# EasyEDA Pro project ProPrj_Tailtip_2026-06-10.epro, schematic Schematic1
Board Name: Board1; Create Date: 2026-06-08; Page Name: P1; Project Name: Tailtip; Schematic Name: Schematic1; Update Date: 2026-06-08; Company: FoxyLab; Drawed: ez4y2f; Page Size: A4; Version: V0.0.1
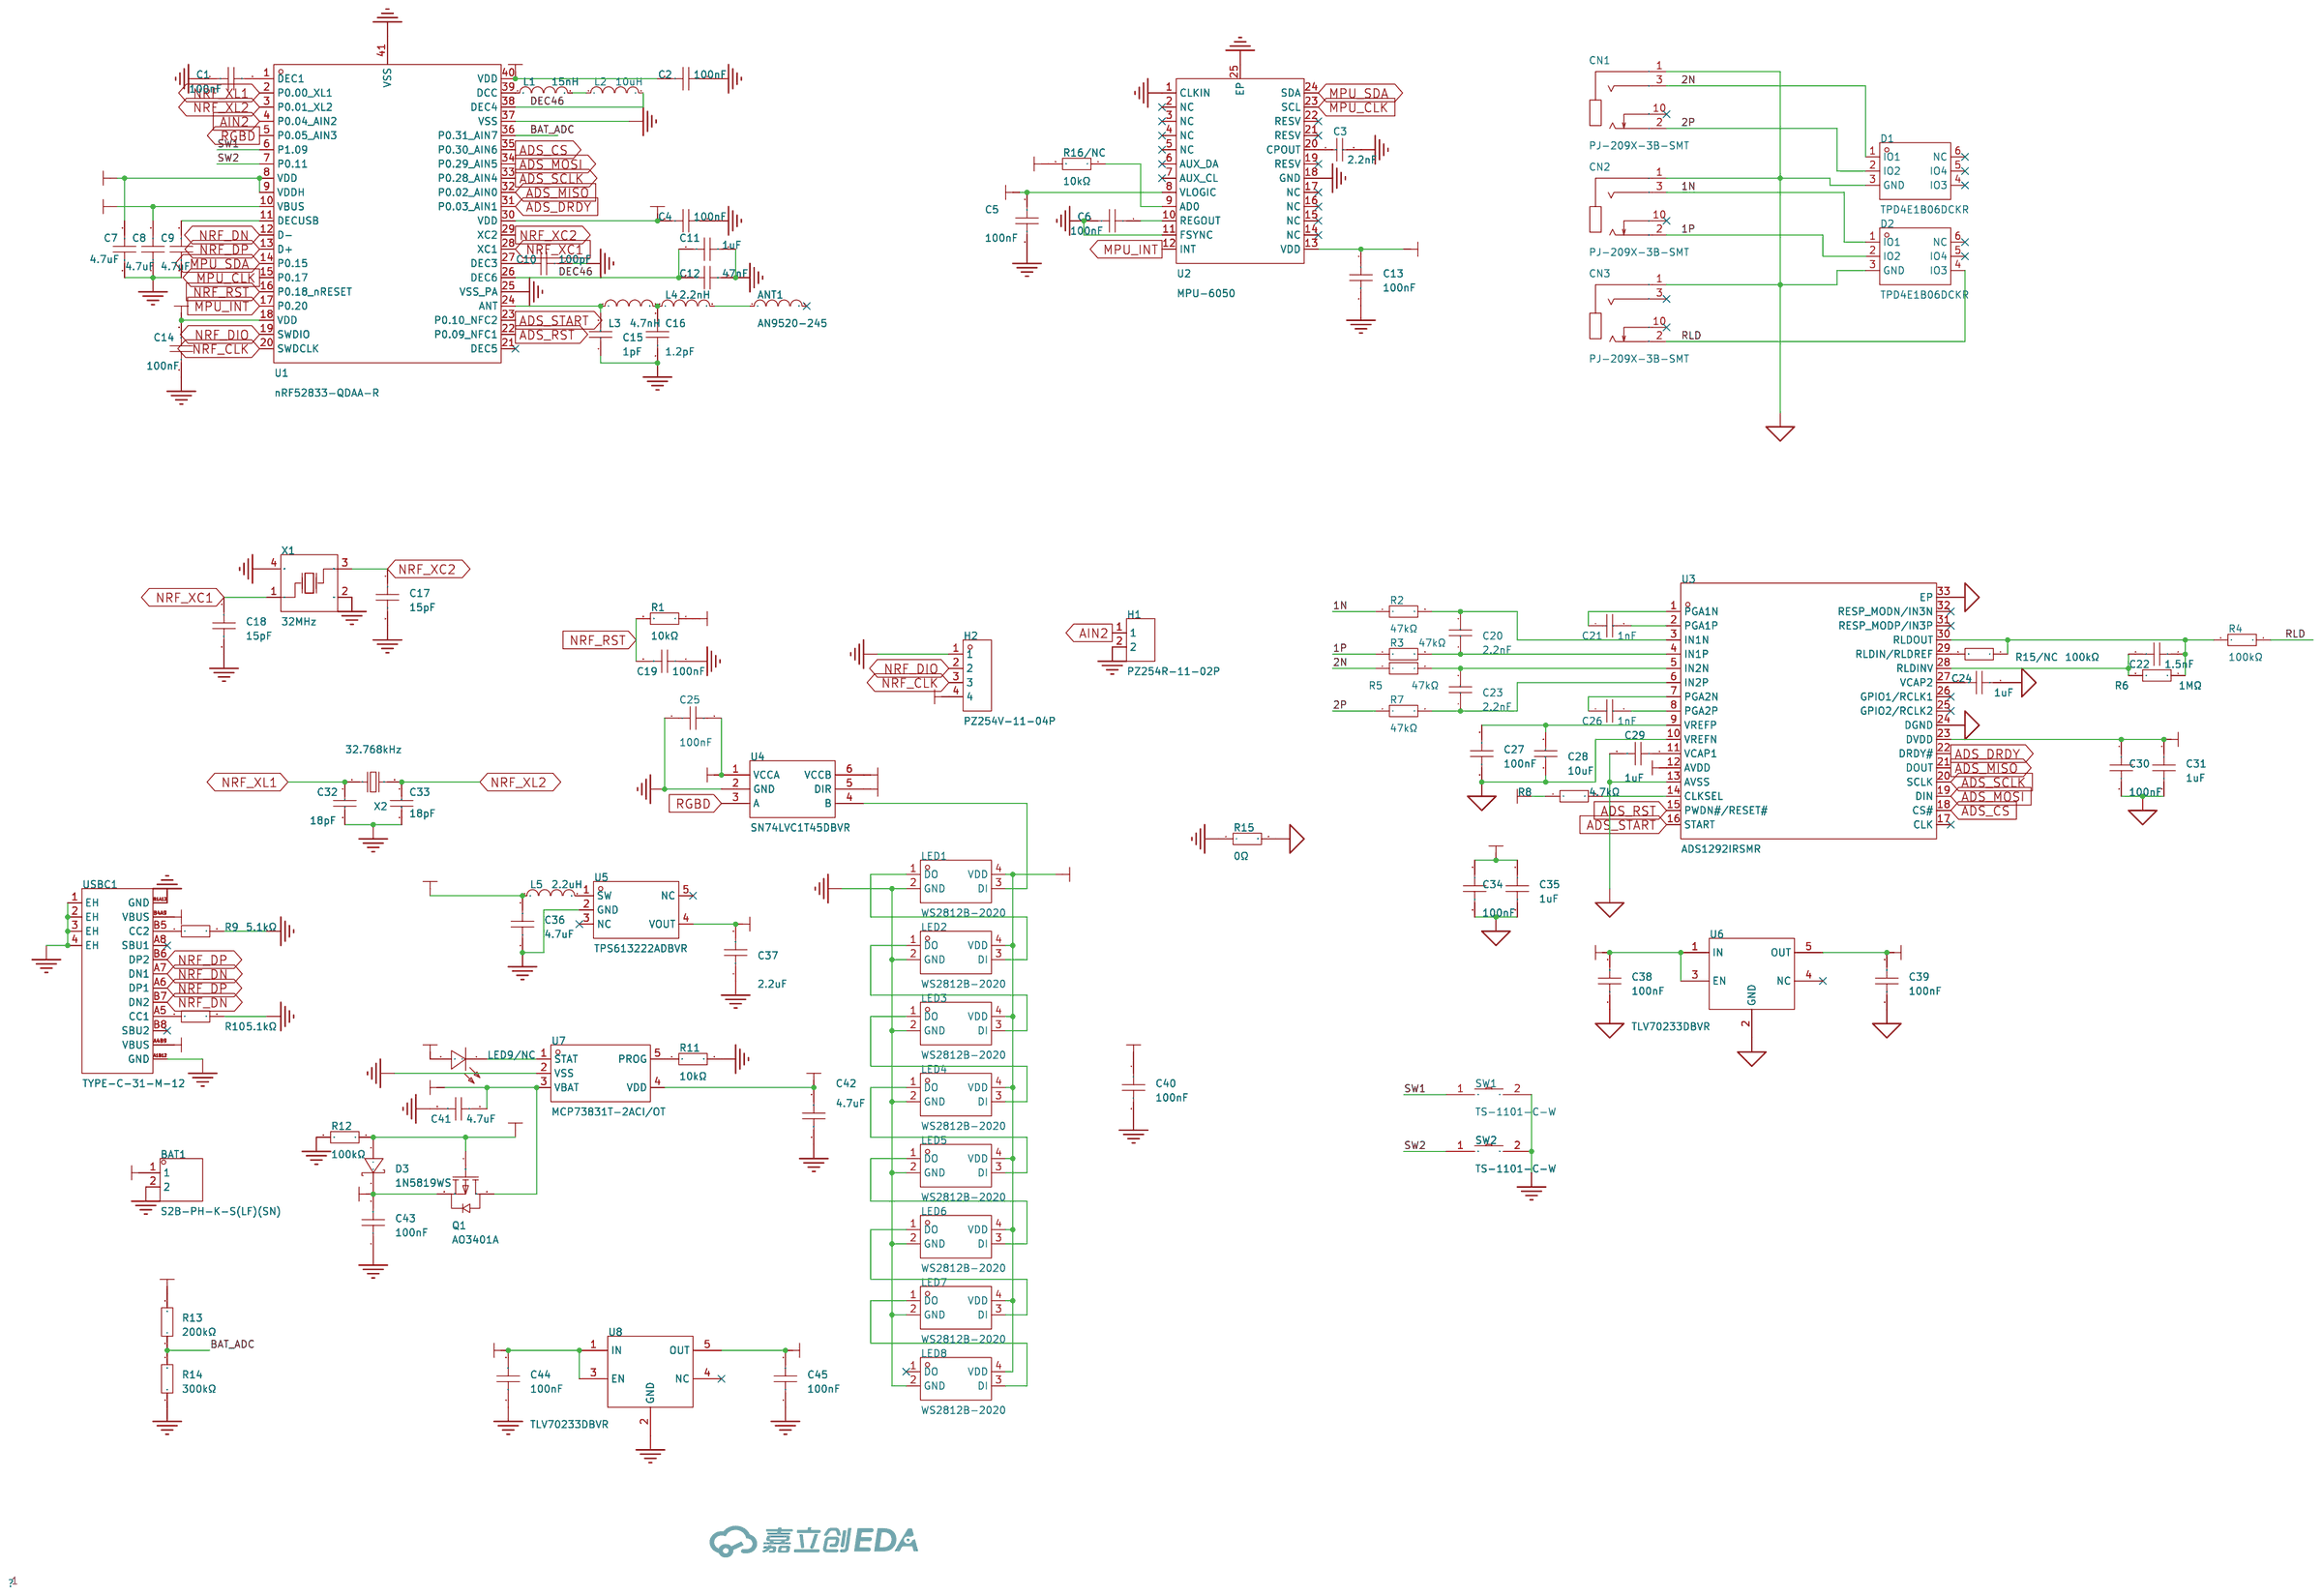
[diagram p0: schematic sheet]

## Parts
ANT1  AN9520-245  [ANT-SMD_L9.5-W2.1]
BAT1  S2B-PH-K-S(LF)(SN)  [CONN-TH_S2B-PH-K-S-LF-SN]
C1  100nF  [C0402]
C2  100nF  [C0402]
C3  2.2nF  [C0402]
C4  100nF  [C0402]
C5  100nF  [C0402]
C6  100nF  [C0402]
C7  4.7uF  [C0402]
C8  4.7uF  [C0402]
C9  4.7uF  [C0402]
C10  100pF  [C0402]
C11  1uF  [C0402]
C12  47nF  [C0402]
C13  100nF  [C0402]
C14  100nF  [C0402]
C15  1pF  [C0402]
C16  1.2pF  [C0402]
C17  15pF  [C0402]
C18  15pF  [C0402]
C19  100nF  [C0402]
C20  2.2nF  [C0402]
C21  1nF  [C0402]
C22  1.5nF  [C0402]
C23  2.2nF  [C0402]
C24  1uF  [C0402]
C25  100nF  [C0402]
C26  1nF  [C0402]
C27  100nF  [C0402]
C28  10uF  [C0402]
C29  1uF  [C0402]
C30  100nF  [C0402]
C31  1uF  [C0402]
C32  18pF  [C0402]
C33  18pF  [C0402]
C34  100nF  [C0402]
C35  1uF  [C0402]
C36  4.7uF  [C0402]
C37  2.2uF  [C0402]
C38  100nF  [C0402]
C39  100nF  [C0402]
C40  100nF  [C0402]
C41  4.7uF  [C0402]
C42  4.7uF  [C0402]
C43  100nF  [C0402]
C44  100nF  [C0402]
C45  100nF  [C0402]
CN1  PJ-209X-3B-SMT  [AUDIO-SMD_PJ-209X-3B-SMT]
CN2  PJ-209X-3B-SMT  [AUDIO-SMD_PJ-209X-3B-SMT]
CN3  PJ-209X-3B-SMT  [AUDIO-SMD_PJ-209X-3B-SMT]
D1  TPD4E1B06DCKR  [SC-70-6_L2.2-W1.3-P0.65-LS2.1-BL]
D2  TPD4E1B06DCKR  [SC-70-6_L2.2-W1.3-P0.65-LS2.1-BL]
D3  1N5819WS  [SOD-323_L1.8-W1.3-LS2.5-RD]
H1  PZ254R-11-02P  [HDR-TH_2P-P2.54-H-M-W10.4]
H2  PZ254V-11-04P  [HDR-TH_4P-P2.54-V-M]
L1  15nH  [L0402]
L2  10uH  [L0603]
L3  4.7nH  [L0402]
L4  2.2nH  [L0402]
L5  2.2uH  [IND-SMD_L1.0-W0.6_PLEA67BCA4R7M-1PT00]
LED1  WS2812B-2020  [LED-SMD_4P-L2.0-W2.0-TL_WS2812B-2020]
LED2  WS2812B-2020  [LED-SMD_4P-L2.0-W2.0-TL_WS2812B-2020]
LED3  WS2812B-2020  [LED-SMD_4P-L2.0-W2.0-TL_WS2812B-2020]
LED4  WS2812B-2020  [LED-SMD_4P-L2.0-W2.0-TL_WS2812B-2020]
LED5  WS2812B-2020  [LED-SMD_4P-L2.0-W2.0-TL_WS2812B-2020]
LED6  WS2812B-2020  [LED-SMD_4P-L2.0-W2.0-TL_WS2812B-2020]
LED7  WS2812B-2020  [LED-SMD_4P-L2.0-W2.0-TL_WS2812B-2020]
LED8  WS2812B-2020  [LED-SMD_4P-L2.0-W2.0-TL_WS2812B-2020]
LED9/NC  NCD0402G1  [LED-SMD_L1.0-W0.5_FC-F1005UGK]
Q1  AO3401A  [SOT-23_L2.9-W1.3-P1.90-LS2.4-BR]
R1  10kΩ  [R0402]
R2  47kΩ  [R0402]
R3  47kΩ  [R0402]
R4  100kΩ  [R0402]
R5  47kΩ  [R0402]
R6  1MΩ  [R0402]
R7  47kΩ  [R0402]
R8  4.7kΩ  [R0402]
R9  5.1kΩ  [R0402]
R10  5.1kΩ  [R0402]
R11  10kΩ  [R0402]
R12  100kΩ  [R0402]
R13  200kΩ  [R0402]
R14  300kΩ  [R0402]
R15  0Ω  [R0402]
R15/NC  100kΩ  [R0402]
R16/NC  10kΩ  [R0402]
SW1  TS-1101-C-W  [SW-SMD_L6.0-W3.3-LS8.0_TS-1101-C-W]
SW2  TS-1101-C-W  [SW-SMD_L6.0-W3.3-LS8.0_TS-1101-C-W]
U1  nRF52833-QDAA-R  [QFN-40_L5.0-W5.0-P0.40-TL-EP3.6]
U2  MPU-6050  [QFN-24_L4.0-W4.0-P0.50-BL-EP2.7]
U3  ADS1292IRSMR  [QFN-32_L4.0-W4.0-P0.40-TL-EP2.7]
U4  SN74LVC1T45DBVR  [SOT-23-6_L2.9-W1.6-P0.95-LS2.8-BR]
U5  TPS613222ADBVR  [TSOT-23-5_L2.9-W1.6-P0.95-LS2.8-BR]
U6  TLV70233DBVR  [SOT-23-5_L3.0-W1.7-P0.95-LS2.8-BR]
U7  MCP73831T-2ACI/OT  [SOT-23-5_L3.0-W1.7-P0.95-LS2.8-BL]
U8  TLV70233DBVR  [SOT-23-5_L3.0-W1.7-P0.95-LS2.8-BR]
USBC1  TYPE-C-31-M-12  [USB-C_SMD-TYPE-C-31-M-12_1]
X1  32MHz  [CRYSTAL-SMD_4P-L3.2-W2.5-BL]
X2  32.768kHz  [FC-135R_L3.2-W1.5]

## Library data of the parts
ANT1 = AN9520-245: 天线类型:贴片天线;中心频率:2.45GHz;带宽:200MHz;增益:1.5dBi;功率:3W;驻波比:2;; Supplier Part: C99665; Manufacturer: Rainsun(霖昱微); Supplier Footprint: SMD,2.1x9.5mm; JLCPCB Part Class: 扩展库; Datasheet: https://item.szlcsc.com/datasheet/AN9520-245/100880.html; Supplier: LCSC; Antenna Type: 贴片天线; Frequency(Center/Band): 2.45GHz; Bandwidth: 200MHz; Peak Gain: 1.5dBi; Impedance: 50Ω; Power: 3W; VSWR: 2; Operating Temperature: -40℃~+85℃; Length: 9.5mm; Width: 2.1mm; Height: 1mm
BAT1 = S2B-PH-K-S(LF)(SN): 插针结构:1x2P;间距:2mm;安装方式:弯插;参考系列:PH;总PIN数:2P;排数:1;每排PIN数:2;行距:-;额定电流:2A;触头材质:黄铜;触头镀层:锡;工作温度:-25℃~+85℃;; LCSC Part Name: 1x2P 间距:2mm 弯插 系列:PH; Supplier Part: C173752; Manufacturer: JST; Supplier Footprint: 弯插,P=2mm; JLCPCB Part Class: 扩展库; Datasheet: https://item.szlcsc.com/datasheet/S2B-PH-K-S(LF)(SN)/185142.html; Supplier: LCSC; Pins Structure: 1x2P; Pitch: 2mm; Mounting Type: 弯插; Reference Series: PH; Number of Pins: 2P; Number of Rows: 1; Number of PINs Per Row: 2; Current Rating: 2A; Contact Material: 黄铜; Contact Plating: 锡; Operating Temperature: -25℃~+85℃; Voltage Rating: 100V; Plastic Material: PA66; Flame Retardant Rating: UL94V-0; Supplementary Features: 打K脚; Color: 白色; Z-Height of the Board: 4.8mm; X-Length of Bottom Edge on Board (Spacing Line): 5.9mm; Y-Width of Bottom Edge on Board: 7.6mm
C1 C2 C4-C6 C13 C14 C19 C25 C27 C30 C34 C38-C40 C43-C45 = CC0402KRX7R7BB104: 容值:100nF;精度:±10%;额定电压:16V;温度系数:X7R;; LCSC Part Name: 100nF ±10% 16V; Supplier Part: C60474; Manufacturer: YAGEO(国巨); Supplier Footprint: 0402; JLCPCB Part Class: 扩展库; Datasheet: https://item.szlcsc.com/datasheet/CC0402KRX7R7BB104/61526.html; Supplier: LCSC; Tolerance: ±10%; Voltage Rating: 16V; Temperature Coefficient: X7R
C3 C20 C23 = CC0402KRX7R9BB222: 容值:2.2nF;精度:±10%;额定电压:50V;温度系数:X7R;; LCSC Part Name: 2.2nF ±10% 50V; Supplier Part: C106861; Manufacturer: YAGEO(国巨); Supplier Footprint: 0402; JLCPCB Part Class: 扩展库; Datasheet: https://item.szlcsc.com/datasheet/CC0402KRX7R9BB222/108077.html; Supplier: LCSC; Tolerance: ±10%; Voltage Rating: 50V; Temperature Coefficient: X7R
C7-C9 C36 C41 C42 = CC0402KRX5R6BB475: 容值:4.7uF;精度:±10%;额定电压:10V;温度系数:X5R;; LCSC Part Name: 4.7uF ±10% 10V; Supplier Part: C326586; Manufacturer: YAGEO(国巨); Supplier Footprint: 0402; JLCPCB Part Class: 扩展库; Datasheet: https://item.szlcsc.com/datasheet/CC0402KRX5R6BB475/306680.html; Supplier: LCSC; Tolerance: ±10%; Voltage Rating: 10V; Temperature Coefficient: X5R
C10 = CC0402FRNPO9BN101: 容值:100pF;精度:±1%;额定电压:50V;温度系数:NP0;; LCSC Part Name: 100pF ±1% 50V; Supplier Part: C327198; Manufacturer: YAGEO(国巨); Supplier Footprint: 0402; JLCPCB Part Class: 扩展库; Datasheet: https://item.szlcsc.com/datasheet/CC0402FRNPO9BN101/307292.html; Supplier: LCSC; Tolerance: ±1%; Voltage Rating: 50V; Temperature Coefficient: NP0
C11 C24 C29 C31 C35 = CC0402KRX7R6BB105: 容值:1uF;精度:±10%;额定电压:10V;温度系数:X7R;; LCSC Part Name: 1uF ±10% 10V; Supplier Part: C7500381; Manufacturer: YAGEO(国巨); Supplier Footprint: 0402; JLCPCB Part Class: 扩展库; Datasheet: https://item.szlcsc.com/datasheet/CC0402KRX7R6BB105/8577179.html; Supplier: LCSC; Tolerance: ±10%; Voltage Rating: 10V; Temperature Coefficient: X7R
C12 = CC0402KRX7R9BB473: 容值:47nF;精度:±10%;额定电压:50V;温度系数:X7R;; LCSC Part Name: 47nF ±10% 50V; Supplier Part: C272875; Manufacturer: YAGEO(国巨); Supplier Footprint: 0402; JLCPCB Part Class: 扩展库; Datasheet: https://item.szlcsc.com/datasheet/CC0402KRX7R9BB473/261267.html; Supplier: LCSC; Tolerance: ±10%; Voltage Rating: 50V; Temperature Coefficient: X7R
C15 = GJM1555C1H1R0BB01D: 容值:1pF;额定电压:50V;温度系数:C0G;; LCSC Part Name: ±0.1pF 1pF 50V; Supplier Part: C76898; Manufacturer: muRata(村田); Supplier Footprint: 0402; JLCPCB Part Class: 扩展库; Datasheet: https://item.szlcsc.com/datasheet/GJM1555C1H1R0BB01D/78025.html; Supplier: LCSC; Voltage Rating: 50V; Temperature Coefficient: C0G
C16 = CC0402BRNPO9BN1R2: 容值:1.2pF;额定电压:50V;温度系数:NP0;; LCSC Part Name: ±0.1pF 1.2pF 50V; Supplier Part: C327292; Manufacturer: YAGEO(国巨); Supplier Footprint: 0402; JLCPCB Part Class: 扩展库; Datasheet: https://item.szlcsc.com/datasheet/CC0402BRNPO9BN1R2/307386.html; Supplier: LCSC; Voltage Rating: 50V; Temperature Coefficient: NP0
C17 C18 = CC0402FRNPO9BN150: 容值:15pF;精度:±1%;额定电压:50V;温度系数:NP0;; LCSC Part Name: 15pF ±1% 50V; Supplier Part: C326803; Manufacturer: YAGEO(国巨); Supplier Footprint: 0402; JLCPCB Part Class: 扩展库; Datasheet: https://item.szlcsc.com/datasheet/CC0402FRNPO9BN150/306897.html; Supplier: LCSC; Tolerance: ±1%; Voltage Rating: 50V; Temperature Coefficient: NP0
C21 C26 = CC0402KRX7R9BB102: 容值:1nF;精度:±10%;额定电压:50V;材质(温度系数):X7R;; LCSC Part Name: 1nF ±10% 50V; Supplier Part: C106205; Manufacturer: YAGEO(国巨); Supplier Footprint: 0402; JLCPCB Part Class: 扩展库; Datasheet: https://atta.szlcsc.com/upload/public/pdf/source/20181008/C309510_22F155564471FAF6A489F7D68F34234E.pdf; Supplier: LCSC; Tolerance: ±10%; Voltage Rated: 50V; Temperature Coefficient: X7R
C22 = CC0402JRX7R9BB152: 容值:1.5nF;精度:±5%;额定电压:50V;温度系数:X7R;; LCSC Part Name: 1.5nF ±5% 50V; Supplier Part: C281752; Manufacturer: YAGEO(国巨); Supplier Footprint: 0402; JLCPCB Part Class: 扩展库; Datasheet: https://item.szlcsc.com/datasheet/CC0402JRX7R9BB152/268135.html; Supplier: LCSC; Tolerance: ±5%; Voltage Rating: 50V; Temperature Coefficient: X7R
C28 = CC0402MRX5R5BB106: 容值:10uF;精度:±20%;额定电压:6.3V;材质(温度系数):X5R;; LCSC Part Name: 10uF ±20% 6.3V; Supplier Part: C105884; Manufacturer: YAGEO(国巨); Supplier Footprint: 0402; JLCPCB Part Class: 扩展库; Datasheet: https://atta.szlcsc.com/upload/public/pdf/source/20181008/C309506_01C87B2C86DBD1236B532041A9B60642.pdf; Supplier: LCSC; Tolerance: ±20%; Voltage Rated: 6.3V; Temperature Coefficient: X5R
C32 C33 = CC0402JRNPO9BN180: 容值:18pF;精度:±5%;额定电压:50V;材质(温度系数):NP0;; LCSC Part Name: 18pF ±5% 50V; Supplier Part: C106202; Manufacturer: YAGEO(国巨); Supplier Footprint: 0402; Datasheet: https://atta.szlcsc.com/upload/public/pdf/source/20170505/1493957838062.pdf; Supplier: LCSC; Tolerance: ±5%; Voltage Rated: 50V; Temperature Coefficient: NP0
C37 = CC0402KRX5R6BB225: 容值:2.2uF;精度:±10%;额定电压:10V;材质(温度系数):X5R;; LCSC Part Name: 2.2uF ±10% 10V; Supplier Part: C326606; Manufacturer: YAGEO(国巨); Supplier Footprint: 0402; JLCPCB Part Class: 扩展库; Datasheet: https://atta.szlcsc.com/upload/public/pdf/source/20181031/C326606_B801EDDCFBA8B15C0DF0980A1CD00BE3.pdf; Supplier: LCSC; Tolerance: ±10%; Voltage Rated: 10V; Temperature Coefficient: X5R
CN1-CN3 = PJ-209X-3B-SMT: 连接器类型:2.5mm耳机座;额定电流:500mA;额定电压:30V;工作温度:-20℃~+70℃;; LCSC Part Name: 2.5mm耳机座; Supplier Part: C500083; Manufacturer: XKB Connection(中国星坤); Supplier Footprint: SMD; Datasheet: https://item.szlcsc.com/datasheet/PJ-209X-3B-SMT/512209.html; Supplier: LCSC; Connector Type: 2.5mm耳机座; Current Rating: 500mA; Voltage Rating (Max): 30V; Operating Temperature: -20℃~+70℃
D1 D2 = TPD4E1B06DCKR: TPD4E1B06 采用 SOT 和 SC70 封装且具有 0.5nA 最大泄漏电流的四路 0.7pF、±5.5V、±12kV ESD 保护二极管; Supplier Part: C840093; Manufacturer: TI(德州仪器); Supplier Footprint: SOT-363; JLCPCB Part Class: 扩展库; Datasheet: https://www.ti.com/cn/lit/gpn/tpd4e1b06; Supplier: LCSC; Type: ESD
D3 = 1N5819WS_C191023: 正向压降(Vf):600mV@1A;直流反向耐压(Vr):40V;整流电流:1A;; LCSC Part Name: 电压:40V 电流:1A; Supplier Part: C191023; Manufacturer: Hottech(合科泰); Supplier Footprint: SOD-323; JLCPCB Part Class: 基础库; Datasheet: https://item.szlcsc.com/datasheet/1N5819WS/213850.html; Supplier: LCSC; Voltage - Forward(Vf@If): 600mV@1A; Voltage - DC Reverse(Vr): 40V; Current - Rectified: 1A; Non-Repetitive Peak Forward Surge Current: 25A
H1 = PZ254R-11-02P: 插针结构:1x2P;间距:2.54mm;行距:-;圆针/方针:方针;安装方式:弯插;排数:单排;总PIN位数:2P;额定电流:3A;额定电压:250V;配合针长度:6mm;塑高:2.5mm;端接针长度:-;触头材质:黄铜;触头镀层:-;工作温度:-40℃~+105℃;颜色:黑色;; LCSC Part Name: 1x2P 间距:2.54mm 方针 弯插; Supplier Part: C492410; Manufacturer: XFCN(兴飞); Supplier Footprint: 弯插,P=2.54mm; JLCPCB Part Class: 扩展库; Datasheet: https://item.szlcsc.com/datasheet/PZ254R-11-02P/502966.html; Supplier: LCSC; Pin Structure: 1x2P; Pitch: 2.54mm; Circluar Pins/Square Pins: 方针; Mounting Type: 弯插; Number of Rows: 单排; Number of Pins: 2P; Current Rating: 3A; Voltage Rating (Max): 250V; Length of Mating Pin: 6mm; Insulation Height: 2.5mm; Contact Material: 黄铜; Operating Temperature: -40℃~+105℃; Color: 黑色
H2 = PZ254V-11-04P: 插针结构:1x4P;间距:2.54mm;行距:-;圆针/方针:方针;安装方式:直插;排数:单排;总PIN位数:4P;额定电流:3A;额定电压:250V;配合针长度:6mm;塑高:2.5mm;端接针长度:3mm;触头材质:-;工作温度:-40℃~+105℃;颜色:黑色;; LCSC Part Name: 1x4P 间距:2.54mm 方针 直插; Supplier Part: C2691448; Manufacturer: XFCN(兴飞); Supplier Footprint: 插件,P=2.54mm; JLCPCB Part Class: 扩展库; Datasheet: https://item.szlcsc.com/datasheet/PZ254V-11-04P/2801085.html; Supplier: LCSC; Pin Structure: 1x4P; Pitch: 2.54mm; Circluar Pins/Square Pins: 方针; Mounting Type: 直插; Number of Rows: 单排; Number of Pins: 4P; Current Rating: 3A; Voltage Rating (Max): 250V; Length of Mating Pin: 6mm; Insulation Height: 2.5mm; Length of End Connection Pin: 3mm; Operating Temperature: -40℃~+105℃; Color: 黑色
L1 = SDCL1005C15NJTDF: 电感值:15nH;精度:±5%;额定电流:300mA;饱和电流(Isat):-;直流电阻(DCR):500mΩ;; LCSC Part Name: 15nH ±5%; Supplier Part: C27143; Manufacturer: Sunlord(顺络); Supplier Footprint: 0402; JLCPCB Part Class: 扩展库; Datasheet: https://atta.szlcsc.com/upload/public/pdf/source/20231027/6126A3AAC5912C34388756BE22DEE00C.pdf; Supplier: LCSC; Tolerance: ±5%; Rated Current: 300mA; DC Resistance(DCR): 500mΩ; Q @ Frequency: 8@100MHz; Frequency - Self Resonant: 2.3GHz
L2 = LQM18FN100M00D: 电感值:10uH;精度:±20%;额定电流:50mA;饱和电流(Isat):50mA;直流电阻(DCR):1.17Ω;; LCSC Part Name: 10uH ±20% 50mA 停产; Supplier Part: C86083; Manufacturer: muRata(村田); Supplier Footprint: 0603; JLCPCB Part Class: 扩展库; Datasheet: https://item.szlcsc.com/datasheet/LQM18FN100M00D/87259.html; Supplier: LCSC; Tolerance: ±20%; Current Rating: 50mA; Current - Saturation (Isat): 50mA; DC Resistance(DCR): 1.17Ω; Frequency - Self Resonant: 30MHz
L3 = LQG15HN4N7S02D: 电感值:4.7nH;精度:-;额定电流:700mA;饱和电流(Isat):-;直流电阻(DCR):160mΩ;; LCSC Part Name: ±0.3nH 4.7nH; Supplier Part: C97989; Manufacturer: muRata(村田); Supplier Footprint: 0402; JLCPCB Part Class: 扩展库; Datasheet: https://item.szlcsc.com/datasheet/LQG15HN4N7S02D/99198.html; Supplier: LCSC; Current Rating: 700mA; DC Resistance(DCR): 160mΩ; Q @ Frequency: 8@100MHz; Frequency - Self Resonant: 6GHz; Type: 叠层电感
L4 = LQG15HS2N2S02D: 电感值:2.2nH;精度:-;额定电流:900mA;饱和电流(Isat):-;直流电阻(DCR):120mΩ;; LCSC Part Name: ±0.3nH 2.2nH; Supplier Part: C86061; Manufacturer: muRata(村田); Supplier Footprint: 0402; Datasheet: https://item.szlcsc.com/datasheet/LQG15HS2N2S02D/87237.html; Supplier: LCSC; Current Rating: 900mA; DC Resistance(DCR): 120mΩ; Q @ Frequency: 8@100MHz; Frequency - Self Resonant: 6GHz; Type: 叠层电感
L5 = PLEA67BBA2R2M-1PT00: 电感值:2.2uH;精度:±20%;额定电流:-;饱和电流(Isat):600mA;直流电阻(DCR):620mΩ;; LCSC Part Name: 2.2uH ±20% 600mA; Supplier Part: C3911260; Manufacturer: TDK; Supplier Footprint: 0402; JLCPCB Part Class: 扩展库; Datasheet: https://item.szlcsc.com/datasheet/PLEA67BBA2R2M-1PT00/4479792.html; Supplier: LCSC; Tolerance: ±20%; Current - Saturation (Isat): 600mA; DC Resistance(DCR): 620mΩ
LED1-LED8 = WS2812B-2020: 12mA，小尺寸，高亮，用于小间距，小尺寸产品（注意防潮，请查阅规格书中对应具体内容）; LCSC Part Name: RGB三色; Supplier Part: C965555; Manufacturer: worldsemi; Supplier Footprint: SMD,2.2x2mm; JLCPCB Part Class: 扩展库; Datasheet: https://item.szlcsc.com/datasheet/WS2812B-2020/1051115.html; Supplier: LCSC; Wavelength: 515.6nm；622.5nm；470.4nm; Luminous Intensity: 200mcd；160mcd；520mcd; Data Transmission Rate: 100KB/S; Voltage - Supply: 5V; Installation method: 正贴
LED9/NC = NCD0402G1: 灯头类型:-;发光颜色:翠绿色;正向压降(Vf):2.6V~3.6V;功率:72mW;正向电流:20mA;波长:515nm~530nm;二极管配置:独立二极管;透镜颜色:-;色温:-;发光强度:270mcd;发光角度:130°;载带方式:-;工作温度:-30℃~+85℃;; LCSC Part Name: 片式发光二极管; Supplier Part: C130723; Manufacturer: 国星光电; Supplier Footprint: 0402; Datasheet: https://item.szlcsc.com/datasheet/NCD0402G1/142012.html; Supplier: LCSC; Illumination Color: 翠绿色; Voltage - Forward(Vf): 2.6V~3.6V; Power(Watts): 72mW; Forward Current: 20mA; Wavelength - Dominant: 515nm~530nm; Peak Wavelength: 520nm; Diode Configuration: 独立二极管; Luminous Intensity: 270mcd; Viewing Angle: 130°; Operating Temperature: -30℃~+85℃
Q1 = AO3401A_C15127: 数量:1个P沟道;漏源电压(Vdss):30V;连续漏极电流(Id):4A;导通电阻(RDS(on)):47mΩ@10V；85mΩ@2.5V；60mΩ@4.5V;耗散功率(Pd):-;阈值电压(Vgs(th)):900mV;; LCSC Part Name: 1个P沟道 耐压:30V 电流:4A; Supplier Part: C15127; Manufacturer: AOS; Supplier Footprint: SOT-23; JLCPCB Part Class: 基础库; Datasheet: https://item.szlcsc.com/datasheet/AO3401A/15801.html; Supplier: LCSC; Number: 1个P沟道; Drain to Source Voltage: 30V; Current - Continuous Drain(Id): 4A; RDS(on): 47mΩ@10V；85mΩ@2.5V；60mΩ@4.5V; Gate Threshold Voltage (Vgs(th)): 900mV; Gate Charge(Qg): 14nC@10V; Input Capacitance(Ciss): 645pF; Reverse Transfer Capacitance (Crss@Vds): 55pF; Output Capacitance(Coss): 80pF
R1 R11 R16/NC = AC0402FR-0710KL: 电阻类型:厚膜电阻;阻值:10kΩ;精度:±1%;功率:62.5mW;工作电压:50V;温度系数:±100ppm/℃;; LCSC Part Name: 厚膜电阻 10kΩ ±1% 62.5mW; Supplier Part: C144807; Manufacturer: YAGEO(国巨); Supplier Footprint: 0402; JLCPCB Part Class: 扩展库; Datasheet: https://item.szlcsc.com/datasheet/AC0402FR-0710KL/156139.html; Supplier: LCSC; Type: 厚膜电阻; Tolerance: ±1%; Power(Watts): 62.5mW; Voltage-Supply(Max): 50V; Temperature Coefficient: ±100ppm/℃; Operating Temperature: -55℃~+155℃
R2 R3 R5 R7 = RC0402FR-0747KL: 电阻类型:厚膜电阻;阻值:47kΩ;精度:±1%;功率:62.5mW;工作电压:50V;温度系数:±100ppm/℃;; LCSC Part Name: 厚膜电阻 47kΩ ±1% 62.5mW; Supplier Part: C93943; Manufacturer: YAGEO(国巨); Supplier Footprint: 0402; JLCPCB Part Class: 扩展库; Datasheet: https://item.szlcsc.com/datasheet/RC0402FR-0747KL/95141.html; Supplier: LCSC; Type: 厚膜电阻; Tolerance: ±1%; Power(Watts): 62.5mW; Voltage-Supply(Max): 50V; Temperature Coefficient: ±100ppm/℃; Operating Temperature: -55℃~+155℃
R4 R12 R15/NC = RC0402FR-07100KL: 电阻类型:厚膜电阻;阻值:100kΩ;精度:±1%;功率:62.5mW;工作电压:50V;温度系数:±100ppm/℃;; LCSC Part Name: 厚膜电阻 100kΩ ±1% 62.5mW; Supplier Part: C60491; Manufacturer: YAGEO(国巨); Supplier Footprint: 0402; JLCPCB Part Class: 扩展库; Datasheet: https://item.szlcsc.com/datasheet/RC0402FR-07100KL/61543.html; Supplier: LCSC; Type: 厚膜电阻; Tolerance: ±1%; Power(Watts): 62.5mW; Voltage-Supply(Max): 50V; Temperature Coefficient: ±100ppm/℃; Operating Temperature: -55℃~+155℃
R6 = RC0402FR-071ML: 电阻类型:厚膜电阻;阻值:1MΩ;精度:±1%;功率:62.5mW;工作电压:50V;温度系数:±100ppm/℃;; LCSC Part Name: 厚膜电阻 1MΩ ±1% 62.5mW; Supplier Part: C138033; Manufacturer: YAGEO(国巨); Supplier Footprint: 0402; JLCPCB Part Class: 扩展库; Datasheet: https://item.szlcsc.com/datasheet/RC0402FR-071ML/149349.html; Supplier: LCSC; Type: 厚膜电阻; Tolerance: ±1%; Power(Watts): 62.5mW; Voltage-Supply(Max): 50V; Temperature Coefficient: ±100ppm/℃; Operating Temperature: -55℃~+155℃
R8 = RC0402FR-074K7L: 电阻类型:厚膜电阻;阻值:4.7kΩ;精度:±1%;功率:62.5mW;工作电压:50V;温度系数:±100ppm/℃;; LCSC Part Name: 厚膜电阻 4.7kΩ ±1% 62.5mW; Supplier Part: C105871; Manufacturer: YAGEO(国巨); Supplier Footprint: 0402; Datasheet: https://item.szlcsc.com/datasheet/RC0402FR-074K7L/107086.html; Supplier: LCSC; Type: 厚膜电阻; Tolerance: ±1%; Power(Watts): 62.5mW; Voltage-Supply(Max): 50V; Temperature Coefficient: ±100ppm/℃; Operating Temperature: -55℃~+155℃
R9 R10 = RC0402FR-075K1L: 电阻类型:厚膜电阻;阻值:5.1kΩ;精度:±1%;功率:62.5mW;工作电压:50V;温度系数:±100ppm/℃;; LCSC Part Name: 厚膜电阻 5.1kΩ ±1% 62.5mW; Supplier Part: C105872; Manufacturer: YAGEO(国巨); Supplier Footprint: 0402; JLCPCB Part Class: 扩展库; Datasheet: https://item.szlcsc.com/datasheet/RC0402FR-075K1L/107087.html; Supplier: LCSC; Type: 厚膜电阻; Tolerance: ±1%; Power(Watts): 62.5mW; Voltage-Supply(Max): 50V; Temperature Coefficient: ±100ppm/℃; Operating Temperature: -55℃~+155℃
R13 = RC0402FR-07200KL: 电阻类型:厚膜电阻;阻值:200kΩ;精度:±1%;功率:62.5mW;最大工作电压:50V;温度系数:±100ppm/℃;; LCSC Part Name: 厚膜电阻 200kΩ ±1% 62.5mW; Supplier Part: C114763; Manufacturer: YAGEO(国巨); Supplier Footprint: 0402; JLCPCB Part Class: 扩展库; Datasheet: https://atta.szlcsc.com/upload/public/pdf/source/20180821/C275644_0D56F95EFF785E7D9A1FEF436B37DA78.pdf; Supplier: LCSC; Type: 厚膜电阻; Tolerance: ±1%; Power(Watts): 62.5mW; Overload Voltage (Max): 50V; Temperature Coefficient: ±100ppm/℃; Operating Temperature Range: -55℃~+155℃
R14 = RC0402FR-07300KL: 电阻类型:厚膜电阻;阻值:300kΩ;精度:±1%;功率:62.5mW;工作电压:50V;温度系数:±100ppm/℃;; LCSC Part Name: 厚膜电阻 300kΩ ±1% 62.5mW; Supplier Part: C138011; Manufacturer: YAGEO(国巨); Supplier Footprint: 0402; Datasheet: https://item.szlcsc.com/datasheet/RC0402FR-07300KL/149327.html; Supplier: LCSC; Type: 厚膜电阻; Tolerance: ±1%; Power(Watts): 62.5mW; Voltage-Supply(Max): 50V; Temperature Coefficient: ±100ppm/℃; Operating Temperature: -55℃~+155℃
R15 = RC0402FR-070RL: 电阻类型:厚膜电阻;阻值:0Ω;精度:±1%;功率:62.5mW;工作电压:50V;温度系数:-;; LCSC Part Name: 厚膜电阻 0Ω ±1% 62.5mW; Supplier Part: C106231; Manufacturer: YAGEO(国巨); Supplier Footprint: 0402; Datasheet: https://item.szlcsc.com/datasheet/RC0402FR-070RL/107446.html; Supplier: LCSC; Type: 厚膜电阻; Tolerance: ±1%; Power(Watts): 62.5mW; Voltage-Supply(Max): 50V; Operating Temperature: -55℃~+155℃
SW1 SW2 = TS-1101-C-W: 电路结构:单刀单掷;按钮形状:矩形按钮;作用力:2.6N;安装方式:立贴;开关长度:6mm;开关宽度:3.6mm;开关高度:2.5mm;带支架:不带支架;触点电流:50mA;额定电压:12V;带灯:无;工作寿命:5万次;; LCSC Part Name: 6*3.6*2.5mm 立贴 轻触开关; Supplier Part: C318938; Manufacturer: XKB Connection(中国星坤); Supplier Footprint: SMD,6x3.6mm; JLCPCB Part Class: 扩展库; Datasheet: https://item.szlcsc.com/datasheet/TS-1101-C-W/300030.html; Supplier: LCSC; Circuit: 单刀单掷; Actuator Style: 矩形按钮; Operating Force: 2.6N; Mounting Type: 立贴; Length: 6mm; Width: 3.6mm; Switch Height: 2.5mm; with Bracket: 不带支架; Contact Current: 50mA; Voltage Rating: 12V; With Lamp: 无; Life: 5万次; Operating Temperature: -30℃~+85℃
U1 = nRF52833-QDAA-R: Supplier Part: C2895249; Manufacturer: NORDIC; Supplier Footprint: QFN-40-EP(5x5); JLCPCB Part Class: 扩展库; Datasheet: https://item.szlcsc.com/datasheet/nRF52833-QDAA-R/3134439.html; Supplier: LCSC
U2 = MPU-6050: 传感器类型:IMU(加速度计+陀螺仪);接口类型:I2C;; Supplier Part: C24112; Manufacturer: TDK InvenSense(应美盛); Supplier Footprint: QFN-24-EP(4x4); JLCPCB Part Class: 扩展库; Datasheet: https://item.szlcsc.com/datasheet/MPU-6050/24852.html; Supplier: LCSC; Accelerometer Sensing Axis: X,Y,Z; Acceleration Measurement Range (MAX): ±16g; Gyroscope Sensing Axis: X,Y,Z; Gyroscope Measurement Range (MAX): ±2000dps; Sensor Type: IMU(加速度计+陀螺仪); Output Bits: 16bit; Interface: I2C; Voltage - Supply: 2.375V~3.46V; Cache Size: 1KB; Standby Current: 5uA; Operating Temperature: -40℃~+85℃; Features: 运动事件检测；同步与时间戳
U3 = ADS1292IRSMR: 工作电压:2.7V~5.25V;工作电流:-;; LCSC Part Name: 用于生物电势测量的低功耗、双通道、24位模拟前端; Supplier Part: C544416; Manufacturer: TI(德州仪器); Supplier Footprint: VQFN-32(4x4); JLCPCB Part Class: 扩展库; Datasheet: https://www.ti.com/cn/lit/gpn/ads1291; Supplier: LCSC; Resolution(Bits): 24位; Gain Drift: 2ppm/℃; Voltage - Supply: 2.7V~5.25V; S/N Ratio: 107dB; Operating Temperature: -40℃~+85℃; Interface: SPI
U4 = SN74LVC1T45DBVR: 数据速率:420Mbps;工作电压(VCCA):1.65V~5.5V;工作电压(VCCB):1.65V~5.5V;通道数:1;每个电路通道数:1;; Supplier Part: C7843; Manufacturer: TI(德州仪器); Supplier Footprint: SOT-23-6; JLCPCB Part Class: 扩展库; Datasheet: https://www.ti.com/cn/lit/gpn/sn74lvc1t45; Supplier: LCSC; Channel Type: 双向; Data Rate: 420Mbps; Voltage - Supply(VCCA): 1.65V~5.5V; Voltage - Supply(VCCB): 1.65V~5.5V; Number of Circuits: 1; Output Type: 三态; Operating Temperature: -40℃~+85℃
U5 = TPS613222ADBVR: 功能类型:升压型;工作电压:900mV~5.5V;输出电压:5V;输出电流:500mA;输出类型:固定;; LCSC Part Name: 升压型 900mV~5.5V; Supplier Part: C2071163; Manufacturer: TI(德州仪器); Supplier Footprint: SOT-23-5; JLCPCB Part Class: 扩展库; Datasheet: https://www.ti.com/cn/lit/gpn/tps61322; Supplier: LCSC; Function: 升压型; Voltage - Supply: 900mV~5.5V; Output Voltage: 5V; Output Current: 500mA; Frequency - Switching: 1.6MHz; Operating Temperature: -40℃~+125℃@(TJ); Synchronous Rectifier: 是; Number of Outputs: 1; Topology: 升压式; Quiescent Current: 6.5uA; Switch tube (built-in/external): 内置; Output Type: 固定; Features: 逐波限流；过流保护
U6 U8 = TLV70233DBVR: 输出极性:正极;工作电压:5.5V;输出电压:3.3V;输出电流:300mA;电源纹波抑制比(PSRR):68dB@(1kHz);输出类型:固定;; LCSC Part Name: 3.3V 300mA 5.5V; Supplier Part: C26833; Manufacturer: TI(德州仪器); Supplier Footprint: SOT-23-5; JLCPCB Part Class: 扩展库; Datasheet: https://www.ti.com/cn/lit/ds/symlink/tlv702.pdf; Supplier: LCSC; Output Configuration: 正极; Voltage - Supply: 5.5V; Output Voltage: 3.3V; Output Current: 300mA; Power Supply Rejection Ratio (PSRR): 68dB@(1kHz); Voltage Dropout: 375mV@(300mA); standby current: 35uA; Noise: 48uVrms; Features: 使能控制；输入欠压保护；过流保护；输出放电；热关断; Operating Temperature: -40℃~+125℃@(Tj); Output Type: 固定; Number of Outputs: 1
U7 = MCP73831T-2ACI/OT: 工作电压:3.75V~6V;最大充电电流:550mA;电池类型:锂电池;电池节数:1;; LCSC Part Name: 单节锂离子/锂聚合物充电管理控制器; Supplier Part: C424093; Manufacturer: MICROCHIP(美国微芯); Supplier Footprint: SOT-23-5; JLCPCB Part Class: 扩展库; Datasheet: https://item.szlcsc.com/datasheet/MCP73831T-2ACI%252FOT/417116.html; Supplier: LCSC; The Chip Type: 充电芯片; Voltage - Supply: 3.75V~6V; Charge Current - Max: 550mA; Charging Saturation Voltage: 4.2V; Type of Battery: 锂电池; Number of Cells: 1; Operating Temperature: -40℃~+85℃; Battery Temperature Detection: 不支持; Supply Current (Iq): 53uA
USBC1 = TYPE-C-31-M-12: 连接器类型:Type-C;协议标准:-;公母:母;安装方式:卧贴;触点数量:16P;端口数量:1;额定电流 - 电源:5A;工作温度:-30℃~+80℃;; LCSC Part Name: Type-C 母 卧贴; Supplier Part: C165948; Manufacturer: 韩国韩荣; Supplier Footprint: SMD; JLCPCB Part Class: 扩展库; Datasheet: https://item.szlcsc.com/datasheet/TYPE-C-31-M-12/177331.html; Supplier: LCSC; Connector Type: Type-C; Gender: 母; Mounting Type: 卧贴; Number of Contacts: 16P; Number of Ports: 1; Current Rating-Power: 5A; Voltage Rating: 20V; Connect-Disconnect Life: 1万次; Length: 7.35mm; Operating Temperature: -30℃~+80℃
X1 = X322532MOB4SI: 晶振类型:贴片晶振;频率:32MHz;常温频差:±10ppm;负载电容:12pF;频率稳定度:±20ppm;; LCSC Part Name: YSX321SL 32MHZ 4P 3225 12PF ±10PPM -40~85℃ (±20PPM); Supplier Part: C9009; Manufacturer: YXC(扬兴晶振); Supplier Footprint: SMD3225-4P; JLCPCB Part Class: 扩展库; Datasheet: https://item.szlcsc.com/datasheet/X322532MOB4SI/9529.html; Supplier: LCSC; Type: 贴片晶振; Normal temperature Frequency Tolerance: ±10ppm; Load Capacitance: 12pF; Frequency Stability: ±20ppm; Operating Temperature: -40℃~+85℃
X2 = Q13FC13500004_C32346: 晶振类型:贴片晶振;频率:32.768kHz;常温频差:±20ppm;负载电容:12.5pF;; LCSC Part Name: 32.768kHz ±20ppm 12.5pF; Supplier Part: C32346; Manufacturer: EPSON(爱普生); Manufacturer Part: Q13FC13500004; Supplier Footprint: SMD3215-2P; Datasheet: https://atta.szlcsc.com/upload/public/pdf/source/20240418/0E0FF5F0356BA3753F616001439D1416.pdf; Supplier: LCSC; Crystal Type: 贴片晶振; Normal temperature Frequency Tolerance: ±20ppm; Load Capacitor: 12.5pF; Equivalent Series Resistance (ESR): 70kΩ; Operating Temperature: -40℃~+85℃

## Nets
3V3: C2.2 C4.2 C5.1 C7.2 C13.1 C14.2 C25.2 C30.1 C31.1 C45.2 H2.4 R1.1 R8.1 R16/NC.2 U1.8(VDD) U1.9(VDDH) U1.18(VDD) U1.30(VDD) U1.40(VDD) U2.8(VLOGIC) U2.13(VDD) U3.23(DVDD) U4.1(VCCA) U4.5(DIR) U8.5(OUT)
3V3A: C34.1 C35.1 C39.2 U3.12(AVDD) U6.5(OUT)
5V0: C37.2 C40.1 LED1.4(VDD) LED2.4(VDD) LED3.4(VDD) LED4.4(VDD) LED5.4(VDD) LED6.4(VDD) LED7.4(VDD) LED8.4(VDD) U4.6(VCCB) U5.4(VOUT)
AGND: C24.1 C27.2 C28.1 C29.2 C30.2 C31.2 C34.2 C35.2 C38.1 C39.1 CN1.1 CN2.1 CN3.1 D1.3(GND) D2.3(GND) R15.2 U3.10(VREFN) U3.13(AVSS) U3.24(DGND) U3.33(EP) U6.2(GND)
GND: BAT1.2 C1.1 C2.1 C3.2 C4.1 C5.2 C6.2 C7.1 C8.1 C9.1 C10.1 C11.1 C12.1 C13.2 C14.1 C15.1 C16.1 C17.2 C18.2 C19.1 C25.1 C32.1 C33.1 C36.2 C37.1 C40.2 C41.2 C42.1 C43.1 C44.1 C45.1 H1.2 H2.1 LED1.2(GND) LED2.2(GND) LED3.2(GND) LED4.2(GND) LED5.2(GND) LED6.2(GND) LED7.2(GND) LED8.2(GND) R9.2 R10.2 R11.2 R12.2 R14.1 R15.1 SW1.2 SW2.2 U1.25(VSS_PA) U1.37(VSS) U1.41(VSS) U2.1(CLKIN) U2.11(FSYNC) U2.18(GND) U2.25(EP) U4.2(GND) U5.2(GND) U7.2(VSS) U8.2(GND) USBC1.1(EH) USBC1.2(EH) USBC1.3(EH) USBC1.4(EH) USBC1.A1B12(GND) USBC1.B1A12(GND) X1.2(GND) X1.4(GND)
VBAT: BAT1.1 C41.1 Q1.3(D) R13.2 U7.3(VBAT)
VBUS: C8.2 C42.2 D3.2(A) LED9/NC.2(A) Q1.1(G) R12.1 U1.10(VBUS) U7.4(VDD) USBC1.A4B9(VBUS) USBC1.B4A9(VBUS)
1N: CN2.3 D2.1(IO1) R2.1
1P: CN2.2 D2.2(IO2) R3.1
2N: CN1.3 D1.1(IO1) R5.1
2P: CN1.2 D1.2(IO2) R7.1
ADS_CS: U1.35(P0.30_AIN6) U3.18(CS#)
ADS_DRDY: U1.31(P0.03_AIN1) U3.22(DRDY#)
ADS_MISO: U1.32(P0.02_AIN0) U3.21(DOUT)
ADS_MOSI: U1.34(P0.29_AIN5) U3.19(DIN)
ADS_RST: U1.22(P0.09_NFC1) U3.15(PWDN#/RESET#)
ADS_SCLK: U1.33(P0.28_AIN4) U3.20(SCLK)
ADS_START: U1.23(P0.10_NFC2) U3.16(START)
AIN2: H1.1 U1.4(P0.04_AIN2)
BAT_ADC: R13.1 R14.2 U1.36(P0.31_AIN7)
DEC46: C11.2 C12.2 L2.2 U1.26(DEC6) U1.38(DEC4)
MPU_CLK: U1.15(P0.17) U2.23(SCL)
MPU_INT: U1.17(P0.20) U2.12(INT)
MPU_SDA: U1.14(P0.15) U2.24(SDA)
NRF_CLK: H2.3 U1.20(SWDCLK)
NRF_DIO: H2.2 U1.19(SWDIO)
NRF_DN: U1.12(D-) USBC1.A7(DN1) USBC1.B7(DN2)
NRF_DP: U1.13(D+) USBC1.A6(DP1) USBC1.B6(DP2)
NRF_RST: C19.2 R1.2 U1.16(P0.18_nRESET)
NRF_XC1: C18.1 U1.28(XC1) X1.1(OSC1)
NRF_XC2: C17.1 U1.29(XC2) X1.3(OSC2)
NRF_XL1: C32.2 U1.2(P0.00_XL1) X2.1
NRF_XL2: C33.2 U1.3(P0.01_XL2) X2.2
RGBD: U1.5(P0.05_AIN3) U4.3(A)
RLD: CN3.2 D2.4(IO3) R4.1
SW1: SW1.1 U1.6(P1.09)
SW2: SW2.1 U1.7(P0.11)
VSYS: C36.1 C38.2 C43.2 C44.2 D3.1(K) L5.1 Q1.2(S) U6.1(IN) U6.3(EN) U8.1(IN) U8.3(EN)
$1N1691: R9.1 USBC1.B5(CC2)
$1N1802: R10.1 USBC1.A5(CC1)
$1N2283: R11.1 U7.5(PROG)
$1N5375: C6.1 U2.10(REGOUT)
$1N5633: C3.1 U2.20(CPOUT)
$1N7464: C20.1 R3.2 U3.4(IN1P)
$1N7470: C23.2 R5.2 U3.5(IN2N)
$1N7476: C23.1 R7.2 U3.6(IN2P)
$1N7484: C20.2 R2.2 U3.3(IN1N)
$1N7560: C21.2 U3.2(PGA1P)
$1N7564: C21.1 U3.1(PGA1N)
$1N7602: C26.2 U3.8(PGA2P)
$1N7604: C26.1 U3.7(PGA2N)
$1N7711: C27.1 C28.2 U3.9(VREFP)
$1N7829: C29.1 U3.11(VCAP1)
$1N8214: R8.2 U3.14(CLKSEL)
$1N8536: C22.2 R6.2 U3.28(RLDINV)
$1N8581: C24.2 U3.27(VCAP2)
$1N11224: LED1.3(DI) U4.4(B)
$1N12511: LED1.1(DO) LED2.3(DI)
$1N12520: LED3.1(DO) LED4.3(DI)
$1N12528: LED2.1(DO) LED3.3(DI)
$1N12539: LED4.1(DO) LED5.3(DI)
$1N12548: LED5.1(DO) LED6.3(DI)
$1N12557: LED6.1(DO) LED7.3(DI)
$1N12578: LED7.1(DO) LED8.3(DI)
$1N13468: C1.2 U1.1(DEC1)
$1N13753: C9.2 U1.11(DECUSB)
$1N13955: C15.2 L3.1 U1.24(ANT)
$1N14068: C16.2 L3.2 L4.1
$1N14239: ANT1.1 L4.2
$1N14478: C10.2 U1.27(DEC3)
$1N14742: L1.1 U1.39(DCC)
$1N14746: L1.2 L2.1
$1N15463: L5.2 U5.1(SW)
Net-(C22-1): C22.1 R4.2 R6.1 R15/NC.1 U3.30(RLDOUT)
Net-(LED9/NC-1): LED9/NC.1(K) U7.1(STAT)
Net-(R15/NC-2): R15/NC.2 U3.29(RLDIN/RLDREF)
Net-(R16/NC-1): R16/NC.1 U2.9(AD0)

Not connected (* = marked no-connect by the designer): ANT1 2*; CN1 10*; CN2 10*; CN3 3* 10*; D1 4(IO3)* 5(IO4)* 6(NC)*; D2 5(IO4)* 6(NC)*; LED8 1(DO)*; U1 21(DEC5)*; U2 2(NC)* 3(NC)* 4(NC)* 5(NC)* 6(AUX_DA)* 7(AUX_CL)* 14(NC)* 15(NC)* 16(NC)* 17(NC)* 19(RESV)* 21(RESV)* 22(RESV)*; U3 17(CLK)* 25(GPIO2/RCLK2)* 26(GPIO1/RCLK1)* 31(RESP_MODP/IN3P)* 32(RESP_MODN/IN3N)*; U5 3(NC)* 5(NC)*; U6 4(NC)*; U8 4(NC)*; USBC1 A8(SBU1)* B8(SBU2)*
